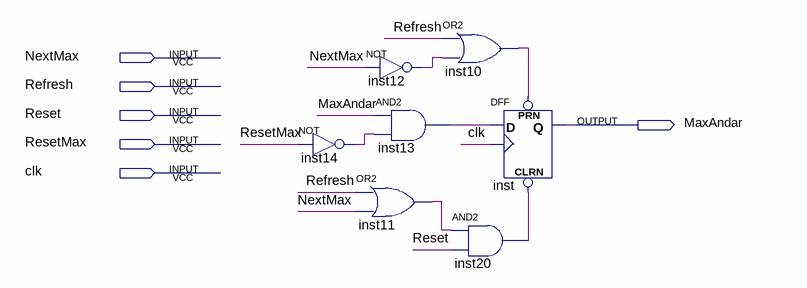
[diagram p0: schematic sheet]
// Quartus schematic MaxAndar.bdf as structural Verilog: 7 symbols, 6 pins
module MaxAndar (
  input  NextMax,
  input  Refresh,
  input  Reset,
  input  ResetMax,
  input  clk,
  output MaxAndar
);

  wire inst10_out, inst11_out, inst12_out, inst13_out, inst14_out, inst20_out;

  not inst12 (inst12_out, NextMax);
  not inst14 (inst14_out, ResetMax);
  or inst11 (inst11_out, Refresh, NextMax);
  or inst10 (inst10_out, Refresh, inst12_out);
  and inst13 (inst13_out, MaxAndar, inst14_out);
  DFF inst (.CLRN(inst20_out), .CLK(clk), .D(inst13_out), .PRN(inst10_out), .Q(MaxAndar));
  and inst20 (inst20_out, inst11_out, Reset);
endmodule
